# Altium schematic sheet SCHEMATIC_INTERFACE.SchDoc: UI_BOARD
size A4; Author: K0M0D0 (BUI_HOANG); CompanyName: None; DrawnBy: K0M0D0 (BUI_HOANG); Engineer: K0M0D0 (BUI_HOANG); Organization: None; Revision: V1.0; SheetNumber: 1; SheetTotal: 9
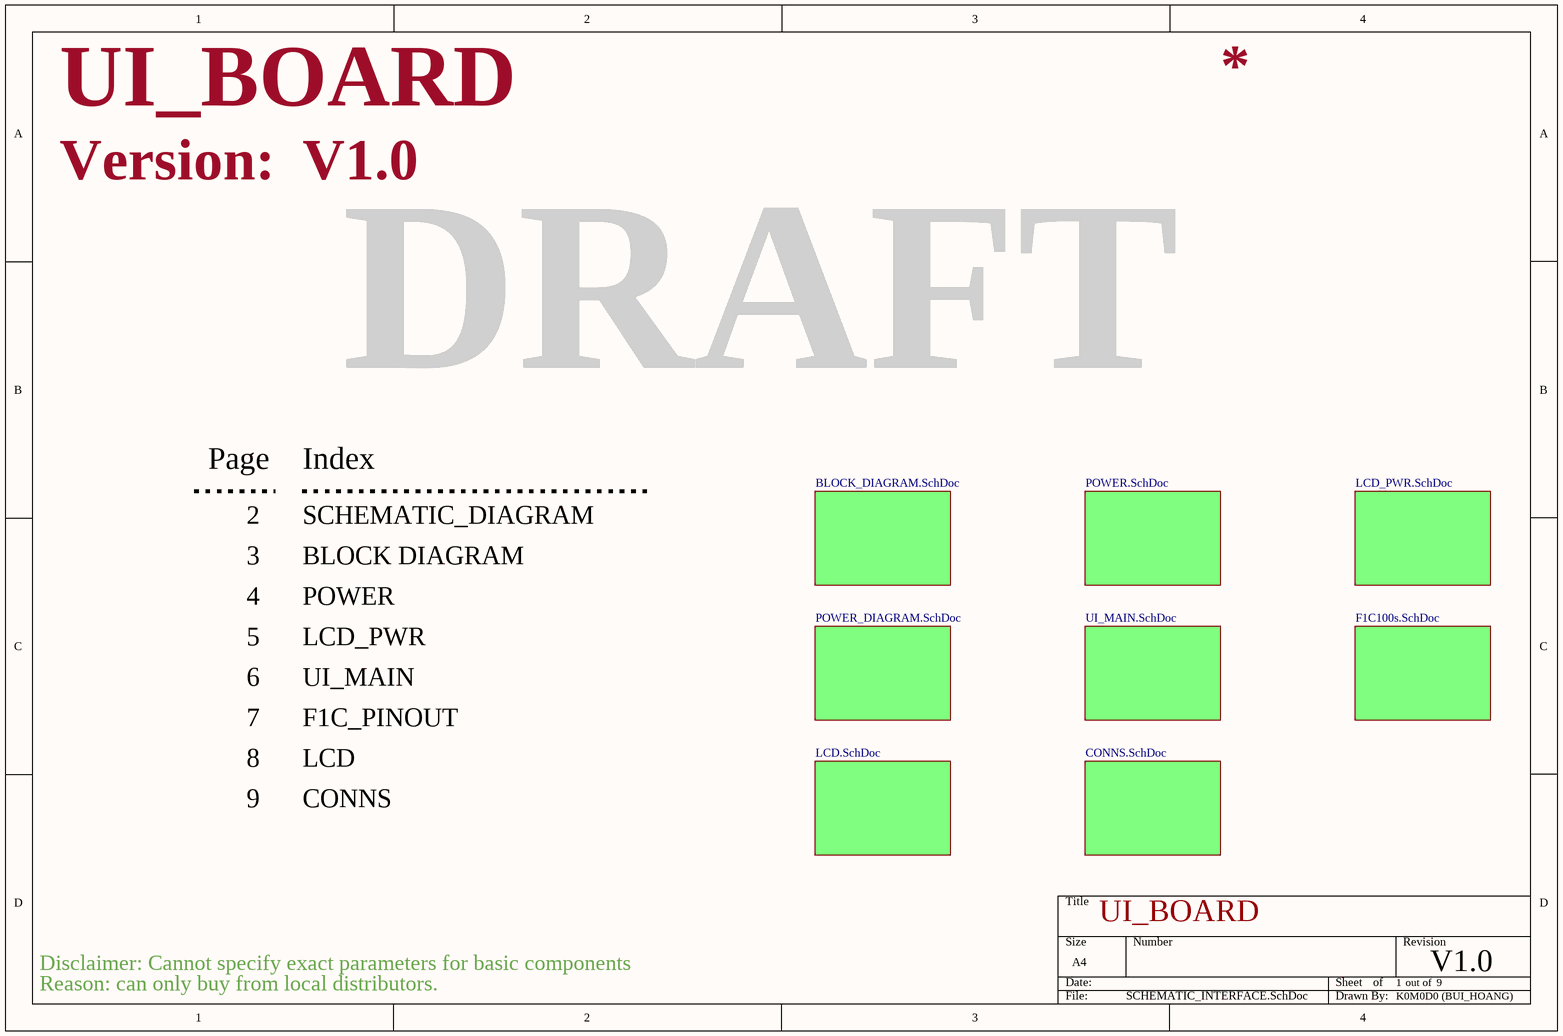
[diagram p0: SCHEMATIC_INTERFACE.SchDoc]

## Sub-sheets
bd_sheet = BLOCK_DIAGRAM.SchDoc: no entries
conn_sheet = CONNS.SchDoc: no entries
F1C = F1C100s.SchDoc: no entries
lcd_sheet = LCD.SchDoc: no entries
pwr_sheet = POWER.SchDoc: no entries
pwr_sheet = LCD_PWR.SchDoc: no entries
pwr_sheet = POWER_DIAGRAM.SchDoc: no entries
stm_sheet = UI_MAIN.SchDoc: no entries

## Notes on the sheet
- Version:
- DRAFT
- Page
- Index
- 2
- 3
- SCHEMATIC_DIAGRAM
- BLOCK DIAGRAM
- 4
- 5
- POWER
- LCD_PWR
- 6
- UI_MAIN
- 7
- 8
- F1C_PINOUT
- LCD
- 9
- CONNS
- Disclaimer: Cannot specify exact parameters for basic components
- out of
- Reason: can only buy from local distributors.